# Altium schematic sheet AnalogConnector.SchDoc
size A4; CompanyName: Technische Hochschule Nürnberg Georg Simon Ohm; Organization: UltraZohm; Address1: Kesslerplatz 12; Address2: 90489 Nürnberg; Address3: GERMANY; DocumentNumber: 3; SheetNumber: 3; SheetTotal: 3; Website: www.ultrazohm.com
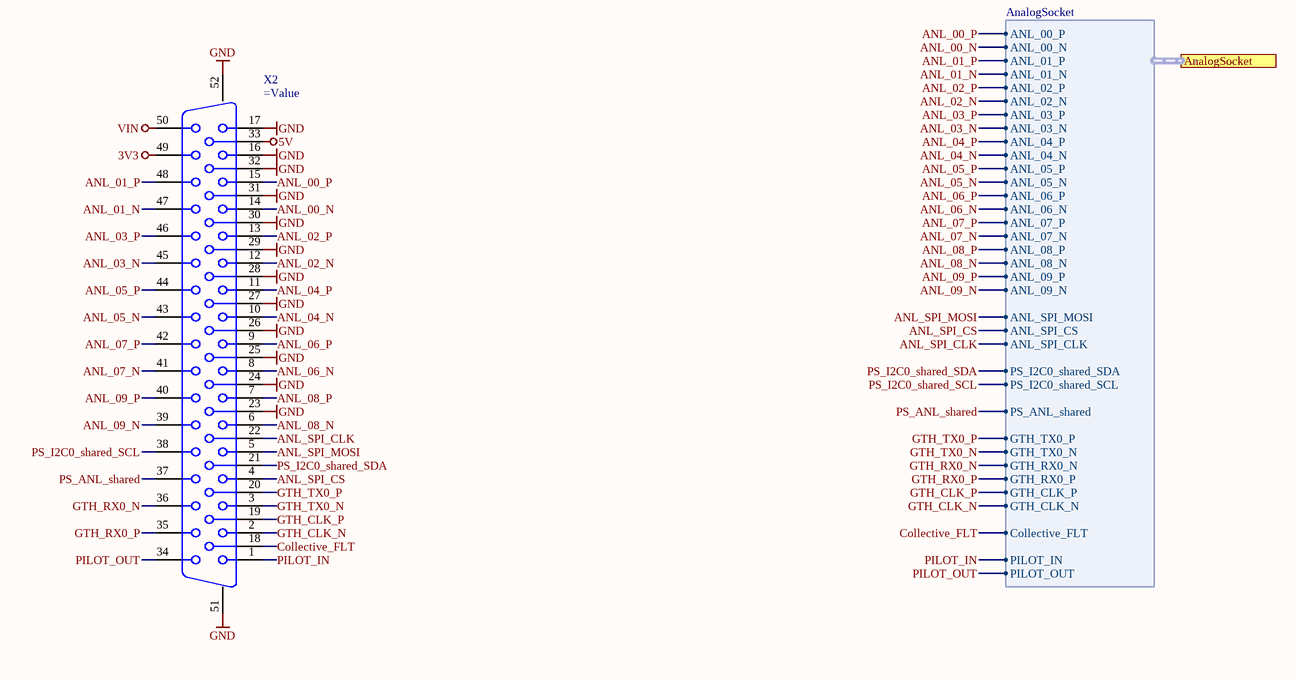
[diagram p0: AnalogConnector.SchDoc]

## Parts
X2  (no value)  [dsub50_male_163A18339X]

## Ports
AnalogSocket (harness AnalogSocket)

## Harnesses
AnalogSocket: ANL_01_P, ANL_01_N, ANL_03_P, ANL_03_N, ANL_05_P, ANL_05_N, ANL_07_P, ANL_07_N, ANL_00_P, ANL_00_N, ANL_02_P, ANL_02_N, ANL_04_P, ANL_04_N, ANL_06_P, ANL_06_N, ANL_08_P, ANL_08_N, ANL_09_P, ANL_09_N, ANL_SPI_MOSI, ANL_SPI_CS, ANL_SPI_CLK, PS_I2C0_shared_SDA, PS_I2C0_shared_SCL, PS_ANL_shared, GTH_TX0_P, GTH_TX0_N, GTH_RX0_N, GTH_RX0_P, GTH_CLK_P, GTH_CLK_N, Collective_FLT, PILOT_IN, PILOT_OUT

## Nets
3V3: X2.49
5V: X2.33
GND: X2.16 X2.17 X2.23 X2.24 X2.25 X2.26 X2.27 X2.28 X2.29 X2.30 X2.31 X2.32 X2.51 X2.52
VIN: X2.50
ANL_00_N: X2.14 ; port AnalogSocket.ANL_00_N
ANL_00_P: X2.15 ; port AnalogSocket.ANL_00_P
ANL_01_N: X2.47 ; port AnalogSocket.ANL_01_N
ANL_01_P: X2.48 ; port AnalogSocket.ANL_01_P
ANL_02_N: X2.12 ; port AnalogSocket.ANL_02_N
ANL_02_P: X2.13 ; port AnalogSocket.ANL_02_P
ANL_03_N: X2.45 ; port AnalogSocket.ANL_03_N
ANL_03_P: X2.46 ; port AnalogSocket.ANL_03_P
ANL_04_N: X2.10 ; port AnalogSocket.ANL_04_N
ANL_04_P: X2.11 ; port AnalogSocket.ANL_04_P
ANL_05_N: X2.43 ; port AnalogSocket.ANL_05_N
ANL_05_P: X2.44 ; port AnalogSocket.ANL_05_P
ANL_06_N: X2.8 ; port AnalogSocket.ANL_06_N
ANL_06_P: X2.9 ; port AnalogSocket.ANL_06_P
ANL_07_N: X2.41 ; port AnalogSocket.ANL_07_N
ANL_07_P: X2.42 ; port AnalogSocket.ANL_07_P
ANL_08_N: X2.6 ; port AnalogSocket.ANL_08_N
ANL_08_P: X2.7 ; port AnalogSocket.ANL_08_P
ANL_09_N: X2.39 ; port AnalogSocket.ANL_09_N
ANL_09_P: X2.40 ; port AnalogSocket.ANL_09_P
ANL_SPI_CLK: X2.22 ; port AnalogSocket.ANL_SPI_CLK
ANL_SPI_CS: X2.4 ; port AnalogSocket.ANL_SPI_CS
ANL_SPI_MOSI: X2.5 ; port AnalogSocket.ANL_SPI_MOSI
Collective_FLT: X2.18 ; port AnalogSocket.Collective_FLT
GTH_CLK_N: X2.2 ; port AnalogSocket.GTH_CLK_N
GTH_CLK_P: X2.19 ; port AnalogSocket.GTH_CLK_P
GTH_RX0_N: X2.36 ; port AnalogSocket.GTH_RX0_N
GTH_RX0_P: X2.35 ; port AnalogSocket.GTH_RX0_P
GTH_TX0_N: X2.3 ; port AnalogSocket.GTH_TX0_N
GTH_TX0_P: X2.20 ; port AnalogSocket.GTH_TX0_P
PILOT_IN: X2.1 ; port AnalogSocket.PILOT_IN
PILOT_OUT: X2.34 ; port AnalogSocket.PILOT_OUT
PS_ANL_shared: X2.37 ; port AnalogSocket.PS_ANL_shared
PS_I2C0_shared_SCL: X2.38 ; port AnalogSocket.PS_I2C0_shared_SCL
PS_I2C0_shared_SDA: X2.21 ; port AnalogSocket.PS_I2C0_shared_SDA

## Notes on the sheet
- Title
- Revision:
- Design Engineer:
- Date:
- Project:
- Sheet
- of

## Library data of the parts
X2 = 163A18339X: D-Sub Standard Connectors DSUB SOLDER PIN ANG 9.4mm; MF: CONEC; Created from: AGeiger; MPN: 163A18339X; Value: 163A18339X; Supplier Part Number 1: D-SUB ST 50GWC; Supplier 1: Reichelt; Supplier 2: Mouser; Supplier 3: Digi-Key; Created: 2021_03_25_AGeiger; Manufacturer Part Number: 163A18339X; PartID: 3; Created On: 22.12.2022 17:03:01; ComponentLink1Description: Datasheet; ComponentLink1URL: https://conec.com/catalog/pub/media/conec/drawings/163A18339X.pdf; Last Updated: 22.12.2022 17:05:07; Manufacturer: CONEC; Mounting Type: THT; Operating Temperature: -55 °C to +125 °C; Series: D-SUB Standard